# Altium schematic sheet 6_Connector.SchDoc: Connector
size A4; ApprovedBy: Alcatraz; CheckedBy: Alcatraz; Author: Alcatraz; CompanyName: DHNLAB; DrawnBy: Alcatraz; Engineer: Alcatraz; Organization: DHNLAB PVT LTD; Address1: DHANBAD; Address2: JHARKHAND; Address3: INDIA; Address4: ASIA; DocumentNumber: 5; Revision: 1.0; SheetNumber: 5; SheetTotal: 6; ProjectTitle: USB-SMB-ISO-CP2112
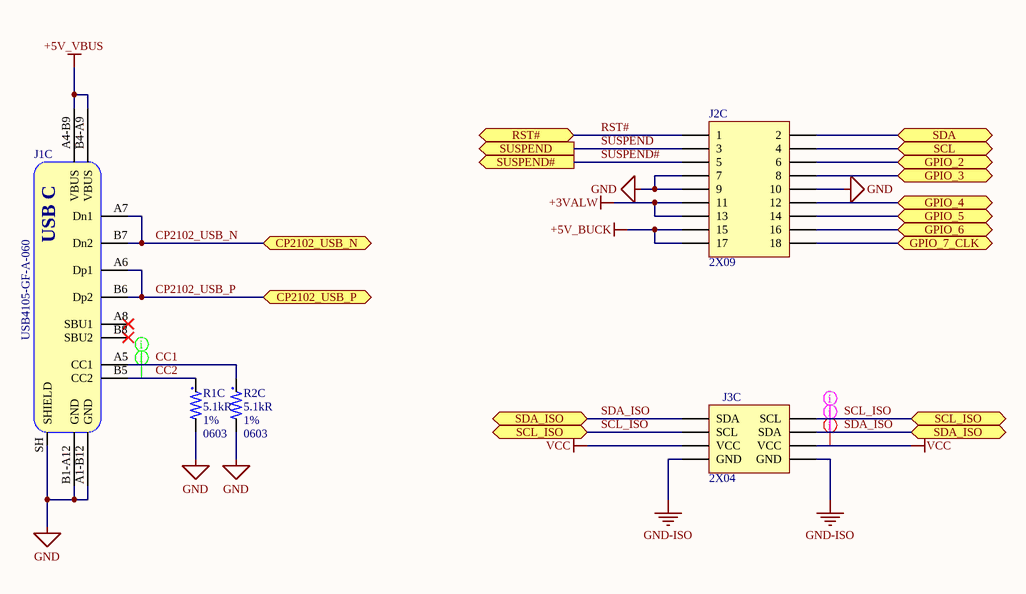
[diagram p0: 6_Connector.SchDoc]

## Parts
J1C  USB4105-GF-A-060  [USB-Type-C-16-Pin-SMT]
J2C  2X09  [PinHeader_2x09_P2.54mm_Vertical]
J3C  2X04  [PinHeader_2x04_P2.54mm_Vertical]
R1C  value 5.1kR  Tolerance: 1%  Case/Package: 0603  [R0603-MFG]  (hidden comment: CRCW06035K10FKEA)
R2C  value 5.1kR  Tolerance: 1%  Case/Package: 0603  [R0603-MFG]  (hidden comment: CRCW06035K10FKEA)

## Ports
CP2102_USB_N (bidir), CP2102_USB_P (bidir), GPIO_2 (bidir), GPIO_3 (bidir), GPIO_4 (bidir), GPIO_5 (bidir), GPIO_6 (bidir), GPIO_7_CLK (bidir), RST# (bidir), SCL (bidir), SCL_ISO (bidir), SDA (bidir), SDA_ISO (bidir), SUSPEND (out), SUSPEND# (out)

## Nets
+3VALW: J2C.11 J2C.13
+5V_BUCK: J2C.15 J2C.17
+5V_VBUS: J1C.A4-B9(VBUS) J1C.B4-A9(VBUS)
GND: J1C.A1-B12(GND) J1C.B1-A12(GND) J1C.SH(SHIELD) J2C.7 J2C.9 J2C.10 R1C.2 R2C.2
GND-ISO: J3C.1(GND) J3C.2(GND)
VCC: J3C.3(VCC) J3C.4(VCC)
CC1: J1C.A5(CC1) R2C.1
CC2: J1C.B5(CC2) R1C.1
CP2102_USB_N: J1C.A7(Dn1) J1C.B7(Dn2) ; port CP2102_USB_N
CP2102_USB_P: J1C.A6(Dp1) J1C.B6(Dp2) ; port CP2102_USB_P
GPIO_2: J2C.6 ; port GPIO_2
GPIO_3: J2C.8 ; port GPIO_3
GPIO_4: J2C.12 ; port GPIO_4
GPIO_5: J2C.14 ; port GPIO_5
GPIO_6: J2C.16 ; port GPIO_6
GPIO_7_CLK: J2C.18 ; port GPIO_7_CLK
RST#: J2C.1 ; port RST#
SCL: J2C.4 ; port SCL
SCL_ISO: J3C.6(SCL) J3C.7(SCL) ; port SCL_ISO
SDA: J2C.2 ; port SDA
SDA_ISO: J3C.5(SDA) J3C.8(SDA) ; port SDA_ISO
SUSPEND: J2C.3 ; port SUSPEND
SUSPEND#: J2C.5 ; port SUSPEND#

Not connected (* = marked no-connect by the designer): J1C A8(SBU1)* B8(SBU2)*

## Layout directives
net class Signal; net class Digital_Signal_Low_Speed: CC1, CC2
net class Power; net class PowerRails_LowVoltage_DC: VCC
net class Signal_50_ohm; net class Digital_Signal_Low_Speed: SCL_ISO, SDA_ISO

## Notes on the sheet
- Title:
- Author:
- Approved:
- Size:
- Date:
- Git Hash:
- A4
- Prj:
- SW Version:
- Variant:
- Edited:
- PUBLIC
- File:
- (in symbol USB-Type-C-16-Pin-SMT) USB C

## Library data of the parts
J1C = USB-Type-C-16-Pin-SMT: USB Connector Type C SMT 16 Pin / (Power pins joints = 12 pins); Manufacturer: GCT; Manufacturer Part Number: USB4105-GF-A-060
J2C = PinHeader 2X09 DU
J3C = I2C_2X04_P2.54mm
R1C R2C = 5.1K: SMD Chip Resistor, 5.1 kOhm, ± 1%, 100 mW, 0603 [1608 Metric], Thick Film, General Purpose; Manufacturer: Vishay; Temperature Coefficient: 100ppm/°C; Max Power Dissipation: 100mW; Voltage Rating: 75V; Supplier 1: Mouser; Manufacturer Part Number: CRCW06035K10FKEA; RoHS: Yes; Category: Chip SMD Resistors; Stock 1: 43654; Pricing 1: 1=0.1, 10=0.034, 50=0.034, 100=0.014, 1000=0.008, 10000=0.004 (USD); Case Code (Imperial): 0603; Case Code (Metric): 1608; Weight: 7.1E-05oz; Contact Plating: Tin; Min Operating Temperature: -55°C; Max Operating Temperature: 155°C; Packaging: Tape and Reel; Series: CRCW; Number of Terminations: 2; Features: Automotive AEC-Q200; Power Rating: 100mW; Voltage Rating (DC): 75V; Package Quantity: 5000; Termination: SMD/SMT; Resistor Type: Thick Film; Construction: Rectangular; Resistance Tolerance: 1%; Technology: THICK FILM; Length: 1.55mm; Width: 0.85mm; Height: 0.45mm; Depth: 0.85mm; Radiation Hardening: No; RoHS Compliant: Yes; Lead Free: 5697LeadFree; Military Standard: Not; Reach SVHC Compliant: Unknown; ComponentLink1URL: https://datasheet.ciiva.com/11809/0900766b80d98afc-11809935.pdf?src-supplier=Rs; ComponentLink1Description: https://datasheet.ciiva.com/11809/0900766b80d98afc-11809935.pdf?src-supplier=Rs; ComponentLink2URL: https://datasheet.ciiva.com/7690/1720486-7690873.pdf?src-supplier=Element14; ComponentLink2Description: https://datasheet.ciiva.com/7690/1720486-7690873.pdf?src-supplier=Element14; ComponentLink3URL: https://datasheet.ciiva.com/15159/getdatasheetpartid-32793-15159338.pdf?src-supplier=Verical; ComponentLink3Description: https://datasheet.ciiva.com/15159/getdatasheetpartid-32793-15159338.pdf?src-supplier=Verical; ComponentLink4URL: https://datasheet.ciiva.com/26314/fld-crcw-e3-data-en-26314742.pdf?src-supplier=Distrelec; ComponentLink4Description: https://datasheet.ciiva.com/26314/fld-crcw-e3-data-en-26314742.pdf?src-supplier=Distrelec; ComponentLink5URL: https://datasheet.ciiva.com/7690/1697337-7690728.pdf?src-supplier=Element14; ComponentLink5Description: https://datasheet.ciiva.com/7690/1697337-7690728.pdf?src-supplier=Element14; ComponentLink6URL: https://datasheet.ciiva.com/3257/dcrcwe3-3257758.pdf?src-supplier=Avnet; ComponentLink6Description: https://datasheet.ciiva.com/3257/dcrcwe3-3257758.pdf?src-supplier=Avnet; ComponentLink7URL: https://datasheet.ciiva.com/16226/dcrcwe3-16226862.pdf?src-supplier=Future+Electronics; ComponentLink7Description: https://datasheet.ciiva.com/16226/dcrcwe3-16226862.pdf?src-supplier=Future+Electronics; Supplier Part Number 1: 71-CRCW0603-5.1K-E3